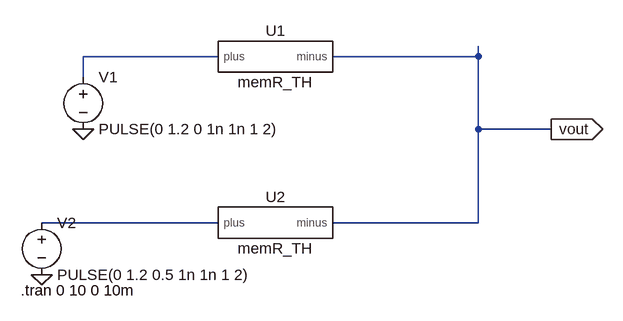
[diagram p0: schematic 忆阻器与门.asc]
忆阻器与门.asc, the LTspice schematic file:
Version 4
SHEET 1 880 680
WIRE 80 112 -128 112
WIRE 480 112 480 96
WIRE 480 112 256 112
WIRE -128 144 -128 112
WIRE 480 224 480 112
WIRE 592 224 480 224
WIRE 80 368 -192 368
WIRE 480 368 480 224
WIRE 480 368 256 368
FLAG -128 224 0
FLAG -192 448 0
FLAG 592 224 vout
IOPIN 592 224 Out
SYMBOL voltage -128 128 R0
WINDOW 123 0 0 Left 0
WINDOW 39 0 0 Left 0
SYMATTR InstName V1
SYMATTR Value PULSE(0 1.2 0 1n 1n 1 2)
SYMBOL voltage -192 352 R0
WINDOW 123 0 0 Left 0
WINDOW 39 0 0 Left 0
SYMATTR InstName V2
SYMATTR Value PULSE(0 1.2 0.5 1n 1n 1 2)
SYMBOL memR_TH 160 112 R0
SYMATTR InstName U1
SYMBOL memR_TH 160 368 R0
SYMATTR InstName U2
TEXT -224 472 Left 2 !.tran 0 10 0 10m

The netlist it stands for:
* 忆阻器与门.asc
V1 N001 0 PULSE(0 1.2 0 1n 1n 1 2)
V2 N002 0 PULSE(0 1.2 0.5 1n 1n 1 2)
XU1 N001 vout memR_TH  ; pins plus minus
XU2 N002 vout memR_TH  ; pins plus minus
.tran 0 10 0 10m
.lib C:\Users\yv236\Documents\LTspice\memR_TH.sub
.backanno
.end